# Altium schematic sheet FPGA - XC6SLX9-2TQG144C.schdoc
size B
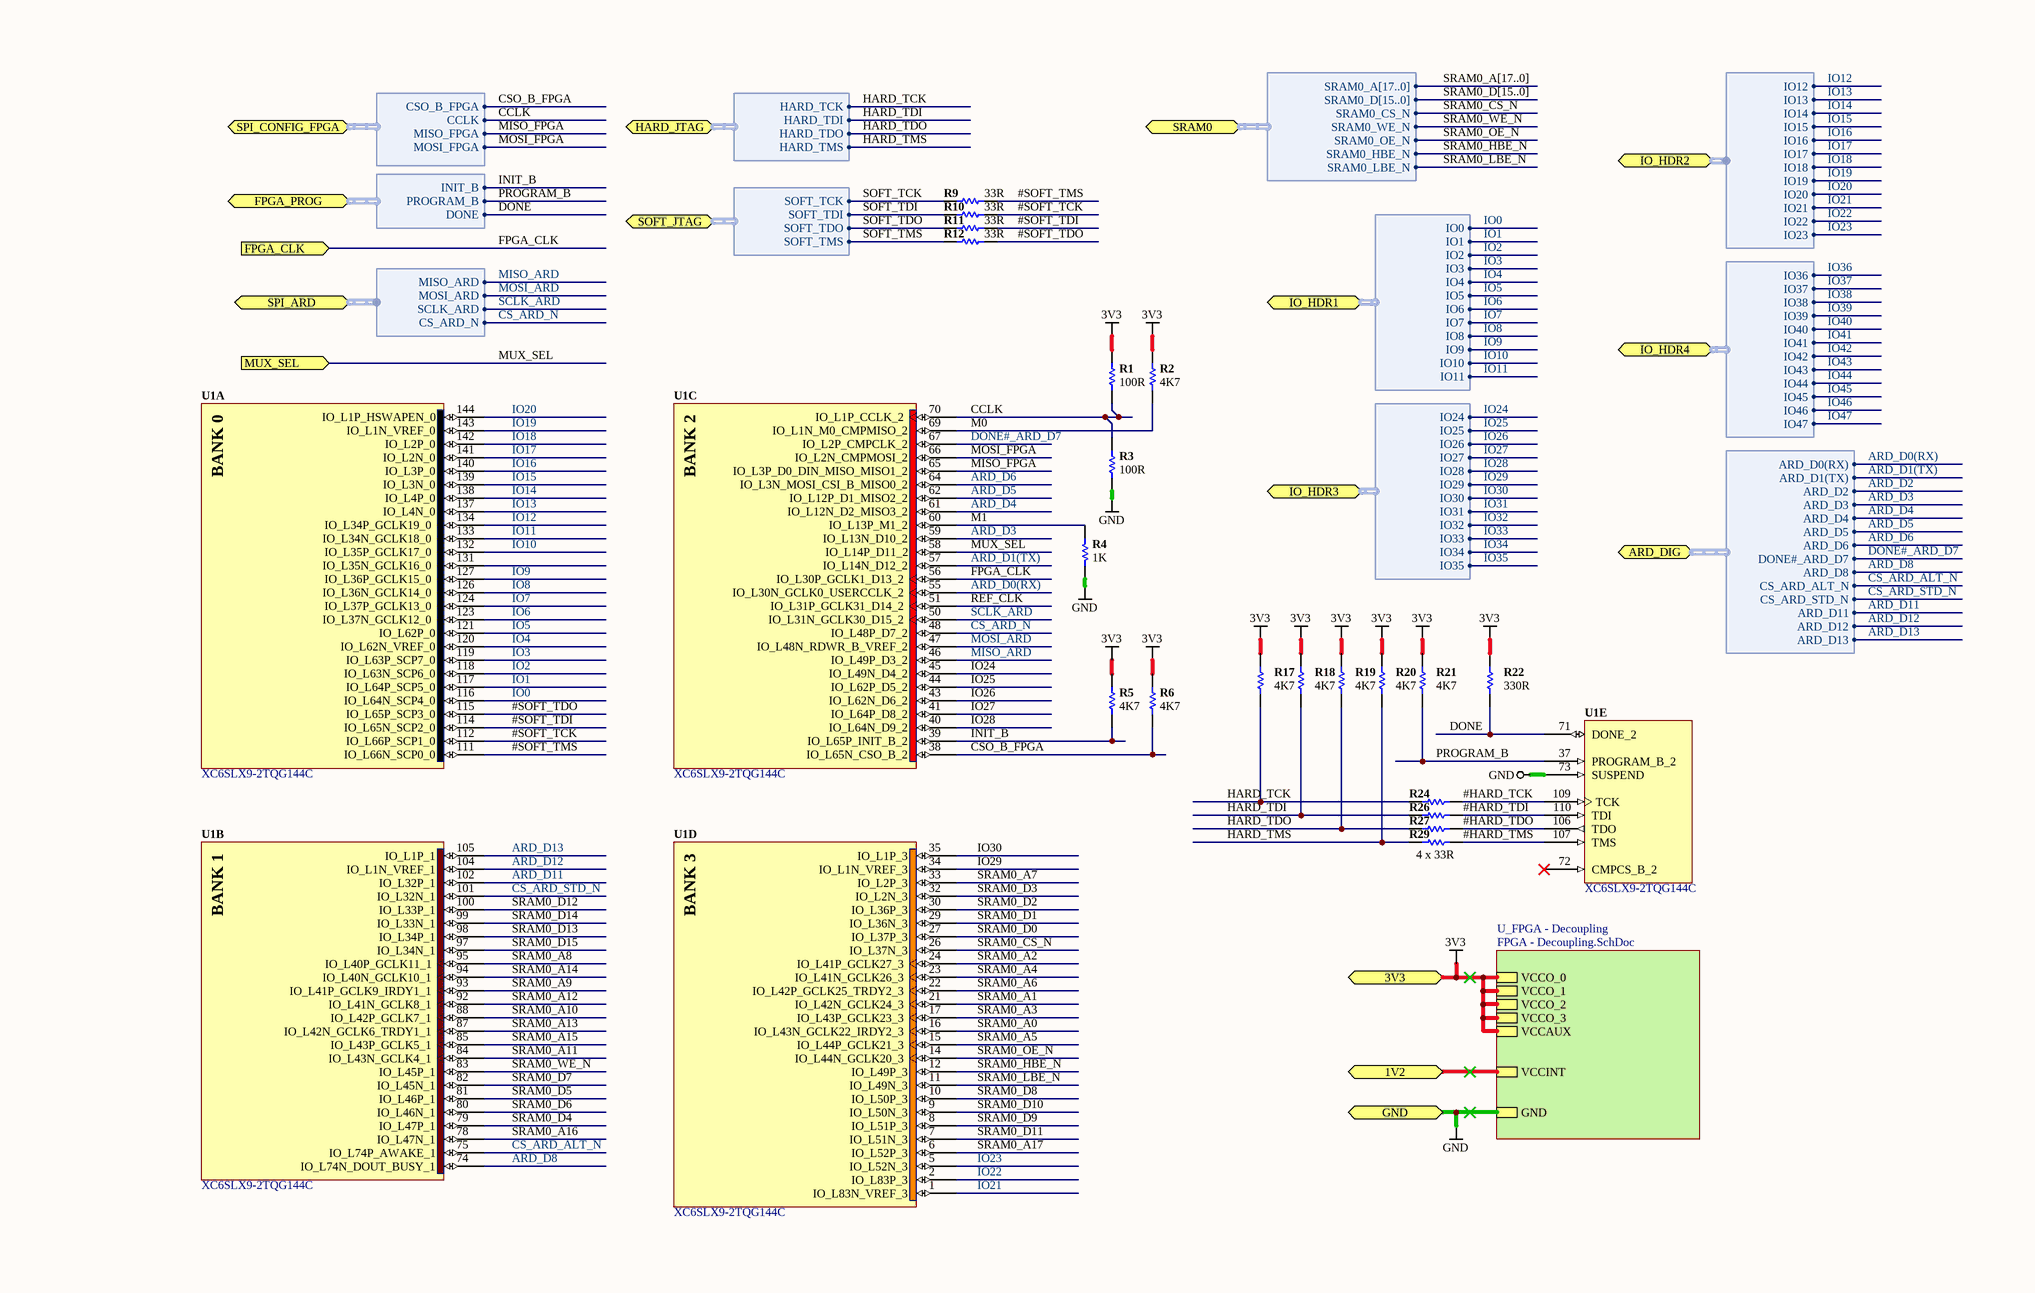
[diagram p0: FPGA - XC6SLX9-2TQG144C.schdoc]

## Parts
(Parts that share a designator on the sheet are numbered #1, #2 ... from top to bottom, then left to right.)
R1  value 100R  [RESC0402(1005)40_L]  (hidden comment: 100R 1 0402)
R2  value 4K7  [RESC0402(1005)40_L]  (hidden comment: 4K7 1 0402)
R3  value 100R  [RESC0402(1005)40_L]  (hidden comment: 100R 1 0402)
R4  value 1K  [RESC0402(1005)40_L]  (hidden comment: 1K 1 0402)
R5  value 4K7  [RESC0402(1005)40_L]  (hidden comment: 4K7 1 0402)
R6  value 4K7  [RESC0402(1005)40_L]  (hidden comment: 4K7 1 0402)
R9  value 33R  [RESC0402(1005)40_L]  (hidden comment: 33R 1 0402)
R10  value 33R  [RESC0402(1005)40_L]  (hidden comment: 33R 1 0402)
R11  value 33R  [RESC0402(1005)40_L]  (hidden comment: 33R 1 0402)
R12  value 33R  [RESC0402(1005)40_L]  (hidden comment: 33R 1 0402)
R17  value 4K7  [RESC0402(1005)40_L]  (hidden comment: 4K7 1 0402)
R18  value 4K7  [RESC0402(1005)40_L]  (hidden comment: 4K7 1 0402)
R19  value 4K7  [RESC0402(1005)40_L]  (hidden comment: 4K7 1 0402)
R20  value 4K7  [RESC0402(1005)40_L]  (hidden comment: 4K7 1 0402)
R21  value 4K7  [RESC0402(1005)40_L]  (hidden comment: 4K7 1 0402)
R22  value 330R  [RESC0402(1005)40_L]  (hidden comment: 330R 1 0402)
R24  33R 1 0402  [RESC0402(1005)40_L]  (value not drawn)
R26  33R 1 0402  [RESC0402(1005)40_L]  (value not drawn)
R27  33R 1 0402  [RESC0402(1005)40_L]  (value not drawn)
R29  33R 1 0402  [RESC0402(1005)40_L]  (value not drawn)
U1#1  XC6SLX9-2TQG144C  [TQG144_N]  (parts A,B,D,E of 7)
U1#2  XC6SLX9-2TQG144C  [TQG144_N]  (part C of 7)

## Sub-sheets
U_FPGA - Decoupling = FPGA - Decoupling.SchDoc: VCCO_0, VCCO_3, VCCO_1, VCCO_2, VCCAUX, VCCINT, GND

## Ports
1V2, 3V3, ARD_DIG (harness ARDUINO_DIGITAL), FPGA_CLK (in), FPGA_PROG (harness FPGA_PROGRAM), GND, HARD_JTAG (harness HARD_JTAG), IO_HDR1 (harness IO_HDR1), IO_HDR2 (harness IO_HDR2), IO_HDR3 (harness IO_HDR3), IO_HDR4 (harness IO_HDR4), MUX_SEL (in), SOFT_JTAG (harness SOFT_JTAG), SPI_ARD (harness SPI_ARD), SPI_CONFIG_FPGA (harness SPI_CONFIG_FPGA), SRAM0 (harness SRAM0)

## Harnesses
SPI_CONFIG_FPGA: CSO_B_FPGA, CCLK, MISO_FPGA, MOSI_FPGA
HARD_JTAG: HARD_TCK, HARD_TDI, HARD_TDO, HARD_TMS
SOFT_JTAG: SOFT_TCK, SOFT_TDI, SOFT_TDO, SOFT_TMS
IO_HDR1: IO0, IO1, IO2, IO3, IO4, IO5, IO6, IO7, IO8, IO9, IO10, IO11
IO_HDR3: IO24, IO25, IO26, IO27, IO28, IO29, IO30, IO31, IO32, IO33, IO34, IO35
IO_HDR4: IO36, IO37, IO38, IO39, IO40, IO41, IO42, IO43, IO44, IO45, IO46, IO47
FPGA_PROGRAM: INIT_B, PROGRAM_B, DONE
IO_HDR2: IO12, IO13, IO16, IO17, IO18, IO19, IO20, IO21, IO22, IO23, IO14, IO15
SRAM0: SRAM0_A[17..0], SRAM0_D[15..0], SRAM0_CS_N, SRAM0_WE_N, SRAM0_OE_N, SRAM0_HBE_N, SRAM0_LBE_N
ARDUINO_DIGITAL: ARD_D0(RX), ARD_D1(TX), ARD_D2, ARD_D3, ARD_D4, ARD_D5, ARD_D6, DONE#_ARD_D7, ARD_D8, CS_ARD_ALT_N, CS_ARD_STD_N, ARD_D11, ARD_D12, ARD_D13
SPI_ARD: MISO_ARD, MOSI_ARD, SCLK_ARD, CS_ARD_N

## Nets
3V3: R1.2 R2.2 R5.2 R6.2 R17.2 R18.2 R19.2 R20.2 R21.2 R22.2 ; port 3V3, sheet U_FPGA - Decoupling/VCCO_0, sheet U_FPGA - Decoupling/VCCO_3, sheet U_FPGA - Decoupling/VCCO_1, sheet U_FPGA - Decoupling/VCCO_2, sheet U_FPGA - Decoupling/VCCAUX
GND: R3.1 R4.1 U1#1.73(SUSPEND) ; port GND, sheet U_FPGA - Decoupling/GND
1V2: port 1V2, sheet U_FPGA - Decoupling/VCCINT
#HARD_TCK: R24.2 U1#1.109(TCK)
#HARD_TDI: R26.2 U1#1.110(TDI)
#HARD_TDO: R27.2 U1#1.106(TDO)
#HARD_TMS: R29.2 U1#1.107(TMS)
#SOFT_TCK: R10.2 U1#1.112(IO_L66P_SCP1_0)
#SOFT_TDI: R11.2 U1#1.114(IO_L65N_SCP2_0)
#SOFT_TDO: R12.2 U1#1.115(IO_L65P_SCP3_0)
#SOFT_TMS: R9.2 U1#1.111(IO_L66N_SCP0_0)
ARD_D0(RX): U1#2.55(IO_L30N_GCLK0_USERCCLK_2) ; port ARD_DIG.ARD_D0(RX)
ARD_D1(TX): U1#2.57(IO_L14N_D12_2) ; port ARD_DIG.ARD_D1(TX)
ARD_D2: port ARD_DIG.ARD_D2
ARD_D3: U1#2.59(IO_L13N_D10_2) ; port ARD_DIG.ARD_D3
ARD_D4: U1#2.61(IO_L12N_D2_MISO3_2) ; port ARD_DIG.ARD_D4
ARD_D5: U1#2.62(IO_L12P_D1_MISO2_2) ; port ARD_DIG.ARD_D5
ARD_D6: U1#2.64(IO_L3N_MOSI_CSI_B_MISO0_2) ; port ARD_DIG.ARD_D6
ARD_D8: U1#1.74(IO_L74N_DOUT_BUSY_1) ; port ARD_DIG.ARD_D8
ARD_D11: U1#1.102(IO_L32P_1) ; port ARD_DIG.ARD_D11
ARD_D12: U1#1.104(IO_L1N_VREF_1) ; port ARD_DIG.ARD_D12
ARD_D13: U1#1.105(IO_L1P_1) ; port ARD_DIG.ARD_D13
CCLK: R1.1 R3.2 U1#2.70(IO_L1P_CCLK_2) ; port SPI_CONFIG_FPGA.CCLK
CS_ARD_ALT_N: U1#1.75(IO_L74P_AWAKE_1) ; port ARD_DIG.CS_ARD_ALT_N
CS_ARD_N: U1#2.48(IO_L48P_D7_2) ; port SPI_ARD.CS_ARD_N
CS_ARD_STD_N: U1#1.101(IO_L32N_1) ; port ARD_DIG.CS_ARD_STD_N
CSO_B_FPGA: R6.1 U1#2.38(IO_L65N_CSO_B_2) ; port SPI_CONFIG_FPGA.CSO_B_FPGA
DONE: R22.1 U1#1.71(DONE_2) ; port FPGA_PROG.DONE
DONE#_ARD_D7: U1#2.67(IO_L2P_CMPCLK_2) ; port ARD_DIG.DONE#_ARD_D7
FPGA_CLK: U1#2.56(IO_L30P_GCLK1_D13_2) ; port FPGA_CLK
HARD_TCK: R17.1 R24.1 ; port HARD_JTAG.HARD_TCK
HARD_TDI: R18.1 R26.1 ; port HARD_JTAG.HARD_TDI
HARD_TDO: R19.1 R27.1 ; port HARD_JTAG.HARD_TDO
HARD_TMS: R20.1 R29.1 ; port HARD_JTAG.HARD_TMS
INIT_B: R5.1 U1#2.39(IO_L65P_INIT_B_2) ; port FPGA_PROG.INIT_B
IO0: U1#1.116(IO_L64N_SCP4_0) ; port IO_HDR1.IO0
IO1: U1#1.117(IO_L64P_SCP5_0) ; port IO_HDR1.IO1
IO2: U1#1.118(IO_L63N_SCP6_0) ; port IO_HDR1.IO2
IO3: U1#1.119(IO_L63P_SCP7_0) ; port IO_HDR1.IO3
IO4: U1#1.120(IO_L62N_VREF_0) ; port IO_HDR1.IO4
IO5: U1#1.121(IO_L62P_0) ; port IO_HDR1.IO5
IO6: U1#1.123(IO_L37N_GCLK12_0) ; port IO_HDR1.IO6
IO7: U1#1.124(IO_L37P_GCLK13_0) ; port IO_HDR1.IO7
IO8: U1#1.126(IO_L36N_GCLK14_0) ; port IO_HDR1.IO8
IO9: U1#1.127(IO_L36P_GCLK15_0) ; port IO_HDR1.IO9
IO10: U1#1.132(IO_L35P_GCLK17_0) ; port IO_HDR1.IO10
IO11: U1#1.133(IO_L34N_GCLK18_0) ; port IO_HDR1.IO11
IO12: U1#1.134(IO_L34P_GCLK19_0) ; port IO_HDR2.IO12
IO13: U1#1.137(IO_L4N_0) ; port IO_HDR2.IO13
IO14: U1#1.138(IO_L4P_0) ; port IO_HDR2.IO14
IO15: U1#1.139(IO_L3N_0) ; port IO_HDR2.IO15
IO16: U1#1.140(IO_L3P_0) ; port IO_HDR2.IO16
IO17: U1#1.141(IO_L2N_0) ; port IO_HDR2.IO17
IO18: U1#1.142(IO_L2P_0) ; port IO_HDR2.IO18
IO19: U1#1.143(IO_L1N_VREF_0) ; port IO_HDR2.IO19
IO20: U1#1.144(IO_L1P_HSWAPEN_0) ; port IO_HDR2.IO20
IO21: U1#1.1(IO_L83N_VREF_3) ; port IO_HDR2.IO21
IO22: U1#1.2(IO_L83P_3) ; port IO_HDR2.IO22
IO23: U1#1.5(IO_L52N_3) ; port IO_HDR2.IO23
IO24: U1#2.45(IO_L49N_D4_2) ; port IO_HDR3.IO24
IO25: U1#2.44(IO_L62P_D5_2) ; port IO_HDR3.IO25
IO26: U1#2.43(IO_L62N_D6_2) ; port IO_HDR3.IO26
IO27: U1#2.41(IO_L64P_D8_2) ; port IO_HDR3.IO27
IO28: U1#2.40(IO_L64N_D9_2) ; port IO_HDR3.IO28
IO29: U1#1.34(IO_L1N_VREF_3) ; port IO_HDR3.IO29
IO30: U1#1.35(IO_L1P_3) ; port IO_HDR3.IO30
IO31: port IO_HDR3.IO31
IO32: port IO_HDR3.IO32
IO33: port IO_HDR3.IO33
IO34: port IO_HDR3.IO34
IO35: port IO_HDR3.IO35
IO36: port IO_HDR4.IO36
IO37: port IO_HDR4.IO37
IO38: port IO_HDR4.IO38
IO39: port IO_HDR4.IO39
IO40: port IO_HDR4.IO40
IO41: port IO_HDR4.IO41
IO42: port IO_HDR4.IO42
IO43: port IO_HDR4.IO43
IO44: port IO_HDR4.IO44
IO45: port IO_HDR4.IO45
IO46: port IO_HDR4.IO46
IO47: port IO_HDR4.IO47
M0: R2.1 U1#2.69(IO_L1N_M0_CMPMISO_2)
M1: R4.2 U1#2.60(IO_L13P_M1_2)
MISO_ARD: U1#2.46(IO_L49P_D3_2) ; port SPI_ARD.MISO_ARD
MISO_FPGA: U1#2.65(IO_L3P_D0_DIN_MISO_MISO1_2) ; port SPI_CONFIG_FPGA.MISO_FPGA
MOSI_ARD: U1#2.47(IO_L48N_RDWR_B_VREF_2) ; port SPI_ARD.MOSI_ARD
MOSI_FPGA: U1#2.66(IO_L2N_CMPMOSI_2) ; port SPI_CONFIG_FPGA.MOSI_FPGA
MUX_SEL: U1#2.58(IO_L14P_D11_2) ; port MUX_SEL
PROGRAM_B: R21.1 U1#1.37(PROGRAM_B_2) ; port FPGA_PROG.PROGRAM_B
REF_CLK: U1#2.51(IO_L31P_GCLK31_D14_2)
SCLK_ARD: U1#2.50(IO_L31N_GCLK30_D15_2) ; port SPI_ARD.SCLK_ARD
SOFT_TCK: R9.1 ; port SOFT_JTAG.SOFT_TCK
SOFT_TDI: R10.1 ; port SOFT_JTAG.SOFT_TDI
SOFT_TDO: R11.1 ; port SOFT_JTAG.SOFT_TDO
SOFT_TMS: R12.1 ; port SOFT_JTAG.SOFT_TMS
SRAM0_A0: U1#1.16(IO_L43N_GCLK22_IRDY2_3)
SRAM0_A1: U1#1.21(IO_L42N_GCLK24_3)
SRAM0_A2: U1#1.24(IO_L41P_GCLK27_3)
SRAM0_A3: U1#1.17(IO_L43P_GCLK23_3)
SRAM0_A4: U1#1.23(IO_L41N_GCLK26_3)
SRAM0_A5: U1#1.15(IO_L44P_GCLK21_3)
SRAM0_A6: U1#1.22(IO_L42P_GCLK25_TRDY2_3)
SRAM0_A7: U1#1.33(IO_L2P_3)
SRAM0_A8: U1#1.95(IO_L40P_GCLK11_1)
SRAM0_A9: U1#1.93(IO_L41P_GCLK9_IRDY1_1)
SRAM0_A10: U1#1.88(IO_L42P_GCLK7_1)
SRAM0_A11: U1#1.84(IO_L43N_GCLK4_1)
SRAM0_A12: U1#1.92(IO_L41N_GCLK8_1)
SRAM0_A13: U1#1.87(IO_L42N_GCLK6_TRDY1_1)
SRAM0_A14: U1#1.94(IO_L40N_GCLK10_1)
SRAM0_A15: U1#1.85(IO_L43P_GCLK5_1)
SRAM0_A16: U1#1.78(IO_L47N_1)
SRAM0_A17: U1#1.6(IO_L52P_3)
SRAM0_CS_N: U1#1.26(IO_L37N_3) ; port SRAM0.SRAM0_CS_N
SRAM0_D0: U1#1.27(IO_L37P_3)
SRAM0_D1: U1#1.29(IO_L36N_3)
SRAM0_D2: U1#1.30(IO_L36P_3)
SRAM0_D3: U1#1.32(IO_L2N_3)
SRAM0_D4: U1#1.79(IO_L47P_1)
SRAM0_D5: U1#1.81(IO_L46P_1)
SRAM0_D6: U1#1.80(IO_L46N_1)
SRAM0_D7: U1#1.82(IO_L45N_1)
SRAM0_D8: U1#1.10(IO_L50P_3)
SRAM0_D9: U1#1.8(IO_L51P_3)
SRAM0_D10: U1#1.9(IO_L50N_3)
SRAM0_D11: U1#1.7(IO_L51N_3)
SRAM0_D12: U1#1.100(IO_L33P_1)
SRAM0_D13: U1#1.98(IO_L34P_1)
SRAM0_D14: U1#1.99(IO_L33N_1)
SRAM0_D15: U1#1.97(IO_L34N_1)
SRAM0_HBE_N: U1#1.12(IO_L49P_3) ; port SRAM0.SRAM0_HBE_N
SRAM0_LBE_N: U1#1.11(IO_L49N_3) ; port SRAM0.SRAM0_LBE_N
SRAM0_OE_N: U1#1.14(IO_L44N_GCLK20_3) ; port SRAM0.SRAM0_OE_N
SRAM0_WE_N: U1#1.83(IO_L45P_1) ; port SRAM0.SRAM0_WE_N

Not connected (* = marked no-connect by the designer): U1#1 72(CMPCS_B_2)* 131(IO_L35N_GCLK16_0)

## Buses and harness runs
bus SRAM0_A[17..0]
bus SRAM0_D[15..0]

## Notes on the sheet
- (near R29) 4 x 33R
- (in symbol CMP-0067-00454-1, part A) BANK 0
- (in symbol CMP-0067-00454-1, part B) BANK 1
- (in symbol CMP-0067-00454-1, part C) BANK 2
- (in symbol CMP-0067-00454-1, part D) BANK 3

## Library data of the parts
R1 R3 = 0402 (1005 Metric) 1/16 W 100R 1 Thick Film Chip Resistor: Power: 1/16 W; Case-Metric: 1005; Case-EIA: 0402; Temp Coefficient ppm/°C: ±100; Tolerance %: 1%; Value (Ohms): 100; Technology: SMT
R2 R5 R6 R17-R21 = 0402 (1005 Metric) 1/16 W 4K7 1 Thick Film Chip Resistor: Case-EIA: 0402; Case-Metric: 1005; Power: 1/16 W; Temp Coefficient ppm/°C: ±100; Tolerance %: 1%; Value (Ohms): 4700; Technology: SMT
R4 = 0402 (1005 Metric) 1/16 W 1K 1 Thick Film Chip Resistor: Power: 1/16 W; Case-Metric: 1005; Case-EIA: 0402; Temp Coefficient ppm/°C: ±100; Tolerance %: 1%; Value (Ohms): 1000; Technology: SMT
R9-R12 R24 R26 R27 R29 = 0402 (1005 Metric) 1/16 W 33R 1 Thick Film Chip Resistor: Power: 1/16 W; Case-EIA: 0402; Case-Metric: 1005; Temp Coefficient ppm/°C: ±100; Tolerance %: 1%; Value (Ohms): 33; Technology: SMT
  R24 R26 R27 R29: Value: 33R
R22 = 0402 (1005 Metric) 1/16 W 330R 1 Thick Film Chip Resistor: Case-EIA: 0402; Case-Metric: 1005; Power: 1/16 W; Temp Coefficient ppm/°C: ±100; Tolerance %: 1%; Value (Ohms): 330; Technology: SMT
U1#1 U1#2 = CMP-0067-00454-1: Spartan-6 LX 1.2V FPGA, 102 User I/Os, 144-Pin TQFP (0.5mm Pitch), Speed Grade 2, Commercial Grade, Pb-Free; PackageVersion: ver1.2, Jun-2004; DatasheetVersion: ver1.6, Nov-2010; PackageDescription: 144-Pin Thin Quad Flat Pack (TQG144) - Pb-Free; PackageReference: TQG144; Code_JEDEC: MS-026-BFB